# EAGLE design E-P-099-R2.2 (EAGLE 7.3.0)
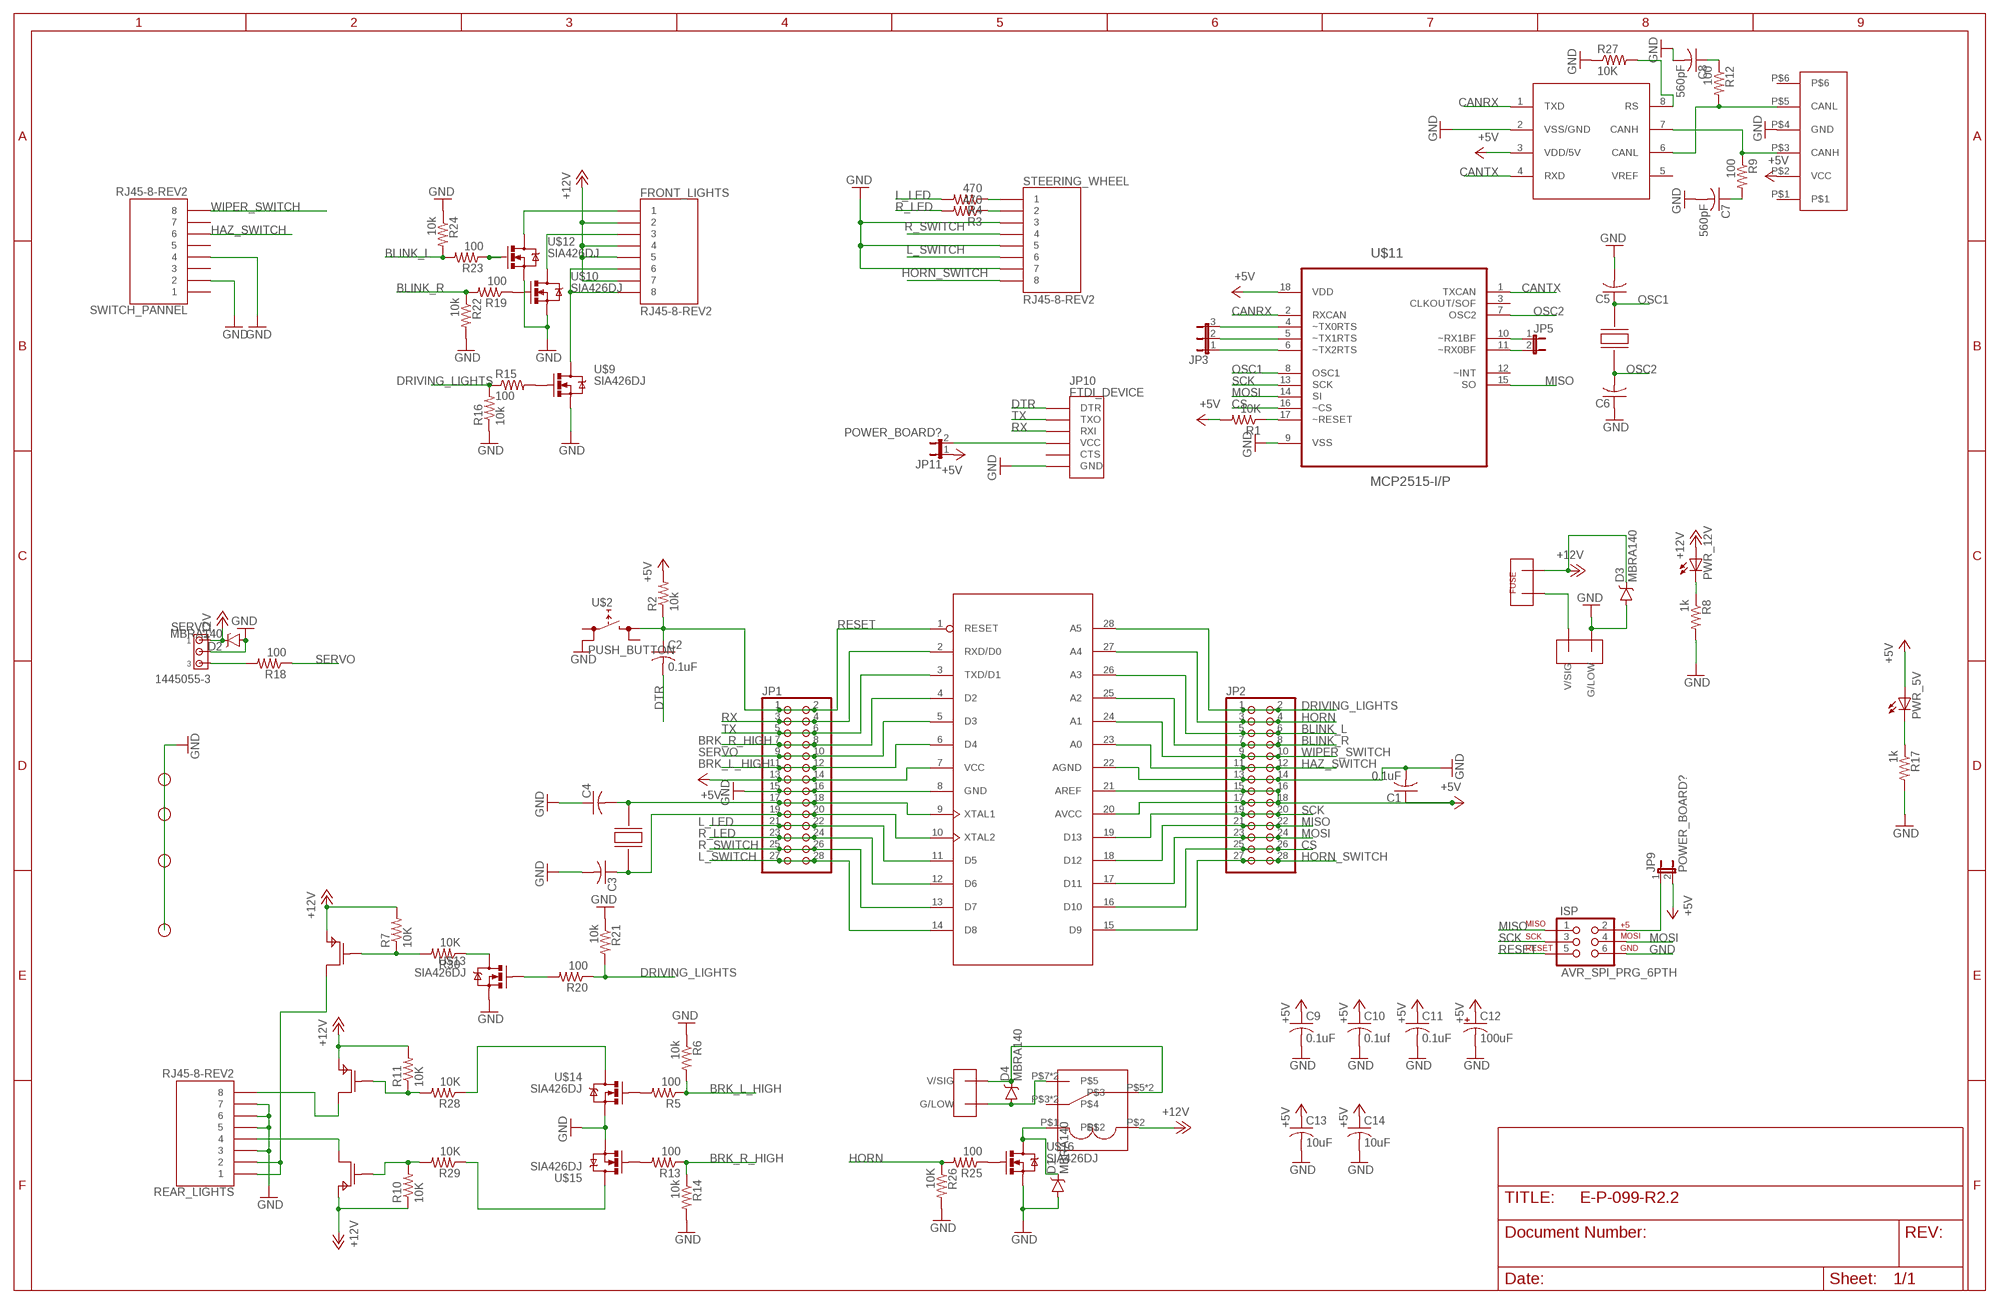
[diagram p0: schematic, sheet 1]

## Parts
C1  0.1uF  C-USC0805  [C0805]
C2  0.1uF  C-USC0805  [C0805]
C3  C-USC0805  [C0805]
C4  C-USC0805  [C0805]
C5  C-USC0805  [C0805]
C6  C-USC0805  [C0805]
C7  560pF  C-USC0805  [C0805]
C8  560pF  C-USC0805  [C0805]
C9  0.1uF  C-USC0805  [C0805]
C10  0.1uf  C-USC0805  [C0805]
C11  0.1uF  C-USC0805  [C0805]
C12  100uF  CAP_POLC  [PANASONIC_C]
C13  10uF  C-USC0805  [C0805]
C14  10uF  C-USC0805  [C0805]
CAN_BUS  CAN_6P6C  [CAN_6P6C]
D1  MBRA140  [SMA-DIODE]
D2  MBRA140  [SMA-DIODE]
D3  MBRA140  [SMA-DIODE]
D4  MBRA140  [SMA-DIODE]
FRONT_LIGHTS  RJ45-8-REV2  [RJ45-8]
HORN  TE770966  [2X1-MATE-N-LOCK]
ISP  AVR_SPI_PRG_6PTH  [2X3]
JP1  PINHD-2X14  [2X14]
JP2  PINHD-2X14  [2X14]
JP3  JP2E  [JP2]
JP4  STAND-OFF  [STAND-OFF]
JP5  JP1E  [JP1]
JP6  STAND-OFF  [STAND-OFF]
JP7  STAND-OFF  [STAND-OFF]
JP8  STAND-OFF  [STAND-OFF]
JP9  POWER_BOARD?  JUMPER-2PTH  [1X02]
JP10  FTDI_DEVICE  [FTDI_DEVICE_SIDE]
JP11  POWER_BOARD?  JUMPER-2PTH  [1X02]
PWR_5V  LEDCHIPLED_1206  [CHIPLED_1206]
PWR_12V  LEDCHIPLED_1206  [CHIPLED_1206]
R1  10K  R-US_M0805  [M0805]
R2  10k  R-US_M0805  [M0805]
R3  470  R-US_M0805  [M0805]
R4  470  R-US_M0805  [M0805]
R5  100  R-US_M0805  [M0805]
R6  10k  R-US_M0805  [M0805]
R7  10K  R-US_M0805  [M0805]
R8  1k  R-US_M0805  [M0805]
R9  100  R-US_M0805  [M0805]
R10  10K  R-US_M0805  [M0805]
R11  10K  R-US_M0805  [M0805]
R12  100  R-US_M0805  [M0805]
R13  100  R-US_M0805  [M0805]
R14  10k  R-US_M0805  [M0805]
R15  100  R-US_M0805  [M0805]
R16  10k  R-US_M0805  [M0805]
R17  1k  R-US_M0805  [M0805]
R18  100  R-US_M0805  [M0805]
R19  100  R-US_M0805  [M0805]
R20  100  R-US_M0805  [M0805]
R21  10k  R-US_M0805  [M0805]
R22  10k  R-US_M0805  [M0805]
R23  100  R-US_M0805  [M0805]
R24  10k  R-US_M0805  [M0805]
R25  100  R-US_M0805  [M0805]
R26  10K  R-US_M0805  [M0805]
R27  10K  R-US_M0805  [M0805]
R28  10K  R-US_M0805  [M0805]
R29  10K  R-US_M0805  [M0805]
R30  10K  R-US_M0805  [M0805]
REAR_LIGHTS  RJ45-8-REV2  [RJ45-8]
SERVO  1445055-3  [1445055-3]
STEERING_WHEEL  RJ45-8-REV2  [RJ45-8]
SWITCH_PANNEL  RJ45-8-REV2  [RJ45-8]
U$1  ATMEGA328  [DIP28-0.3IN]
U$2  PUSH_BUTTON  [PUSHBUTTON]
U$3  MCP2551DIP  [DIP8]
U$4  CRYSTAL  [7A_CRYSTAL]
U$5  TE770966  [2X1-MATE-N-LOCK]
U$6  CRYSTAL  [7A_CRYSTAL]
U$7  RELAY  [RTD34012]
U$8  FUSEMINI-BLADE  [MINI-BLADE-FUSE]
U$9  SIA426DJ  [SC70-6L]
U$10  SIA426DJ  [SC70-6L]
U$11  MCP2515-I/P  [DIP254P762X432-18]
U$12  SIA426DJ  [SC70-6L]
U$13  SIA426DJ  [SC70-6L]
U$14  SIA426DJ  [SC70-6L]
U$15  SIA426DJ  [SC70-6L]
U$16  SIA426DJ  [SC70-6L]
U$17  SIA449DJ  [SIA449DJ-T1-GE3CT-ND]
U$18  SIA449DJ  [SIA449DJ-T1-GE3CT-ND]
U$19  SIA449DJ  [SIA449DJ-T1-GE3CT-ND]

## Nets
+5V: C1.1 C9.1 C10.1 C11.1 C12.+ C13.1 C14.1 CAN_BUS.P$2(VCC) JP1.13 JP1.14 JP2.15 JP2.16 JP2.17 JP2.18 JP9.2 JP11.1 PWR_5V.A R1.2 R2.2 U$1.7(VCC) U$1.20(AVCC) U$1.21(AREF) U$3.3(VDD/5V) U$11.18(VDD)
+12V: D2.C D3.C FRONT_LIGHTS.2 FRONT_LIGHTS.4 FRONT_LIGHTS.5 FRONT_LIGHTS.7 PWR_12V.A R7.2 R10.1 R11.2 SERVO.1 U$7.P$2 U$8.OUT U$17.P$5(P$S) U$17.P$6(P$S) U$18.P$5(P$S) U$18.P$6(P$S) U$19.P$5(P$S) U$19.P$6(P$S)
BLINK_L: JP2.5 JP2.6 R23.2 R24.2 U$1.26(A3)
BLINK_R: JP2.7 JP2.8 R19.2 R22.1 U$1.25(A2)
BRK_L_HIGH: JP1.11 JP1.12 R5.1 R6.2 U$1.6(D4)
BRK_R_HIGH: JP1.7 JP1.8 R13.1 R14.1 U$1.4(D2)
CANRX: U$3.1(TXD) U$11.2(RXCAN)
CANTX: U$3.4(RXD) U$11.1(TXCAN)
CS: JP2.25 JP2.26 U$1.16(D10) U$11.16(~CS)
DRIVING_LIGHTS: JP2.1 JP2.2 R15.1 R16.2 R20.1 R21.2 U$1.28(A5)
DTR: C2.2 JP10.P$1(DTR)
GND: C1.2 C3.2 C4.1 C5.2 C6.1 C7.2 C8.2 C9.2 C10.2 C11.2 C12.- C13.2 C14.2 CAN_BUS.P$4(GND) D1.A D2.A D3.A ISP.6 JP1.15 JP1.16 JP2.13 JP2.14 JP10.P$6(GND) R6.1 R8.2 R14.2 R16.1 R17.2 R21.1 R22.2 R24.1 R26.2 R27.1 REAR_LIGHTS.3 REAR_LIGHTS.5 REAR_LIGHTS.6 REAR_LIGHTS.7 SERVO.2 STEERING_WHEEL.3 STEERING_WHEEL.5 STEERING_WHEEL.7 SWITCH_PANNEL.2 SWITCH_PANNEL.4 U$1.8(GND) U$1.22(AGND) U$2.L2(L) U$3.2(VSS/GND) U$5.CIRCUIT2(G/LOW) U$9.S@0(S) U$9.S@1(S) U$10.S@0(S) U$10.S@1(S) U$11.9(VSS) U$12.S@0(S) U$12.S@1(S) U$13.S@0(S) U$13.S@1(S) U$14.S@0(S) U$14.S@1(S) U$15.S@0(S) U$15.S@1(S) U$16.S@0(S) U$16.S@1(S)
HAZ_SWITCH: JP2.11 JP2.12 SWITCH_PANNEL.6 U$1.23(A0)
HORN: JP2.3 JP2.4 R25.2 R26.1 U$1.27(A4)
HORN_SWITCH: JP2.27 JP2.28 STEERING_WHEEL.8 U$1.15(D9)
L_LED: JP1.21 JP1.22 R4.2 U$1.11(D5)
L_SWITCH: JP1.27 JP1.28 STEERING_WHEEL.6 U$1.14(D8)
MISO: ISP.1 JP2.21 JP2.22 U$1.18(D12) U$11.15(SO)
MOSI: ISP.4 JP2.23 JP2.24 U$1.17(D11) U$11.14(SI)
N$1: CAN_BUS.P$3(CANH) R9.1 U$3.7(CANH)
N$2: PWR_12V.C R8.1
N$3: REAR_LIGHTS.4 U$19.P$1(P$D)
N$4: C8.1 R12.1
N$5: ISP.2 JP9.1
N$6: C7.1 R9.2
N$7: R13.2 U$15.G
N$8: FRONT_LIGHTS.1 U$12.D
N$9: CAN_BUS.P$5(CANL) R12.2 U$3.6(CANL)
N$10: REAR_LIGHTS.1 REAR_LIGHTS.2 U$17.P$1(P$D)
N$11: C3.1 JP1.19 JP1.20 U$1.10(XTAL2) U$4.P$1
N$12: R3.1 STEERING_WHEEL.2
N$13: R4.1 STEERING_WHEEL.1
N$14: FRONT_LIGHTS.3 U$10.D
N$15: R18.2 SERVO.3
N$16: R15.2 U$9.G
N$17: FRONT_LIGHTS.6 FRONT_LIGHTS.8 U$9.D
N$18: D4.C HORN.CIRCUIT1(V/SIG) U$7.P$5 U$7.P$6
N$19: C4.2 JP1.17 JP1.18 U$1.9(XTAL1) U$4.P$2
N$20: JP3.3 U$11.4(~TX0RTS)
N$21: R5.2 U$14.G
N$22: R7.1 R30.2 U$17.P$4(P$G)
N$23: JP10.P$4(VCC) JP11.2
N$24: R20.2 U$13.G
N$25: REAR_LIGHTS.8 U$18.P$1(P$D)
N$26: R27.2 U$3.8(RS)
N$27: R1.1 U$11.17(~RESET)
N$28: D4.A HORN.CIRCUIT2(G/LOW) U$7.P$7 U$7.P$8
N$29: R25.1 U$16.G
N$30: D1.C U$7.P$1 U$16.D
N$31: R11.1 R28.2 U$18.P$4(P$G)
N$32: R10.2 R29.2 U$19.P$4(P$G)
N$33: R19.1 U$10.G
N$34: R30.1 U$13.D
N$37: R23.1 U$12.G
N$41: PWR_5V.C R17.1
N$43: R28.1 U$14.D
N$45: R29.1 U$15.D
N$47: U$5.CIRCUIT1(V/SIG) U$8.IN
N$52: JP3.2 U$11.5(~TX1RTS)
N$56: JP3.1 U$11.6(~TX2RTS)
N$62: JP5.1 U$11.10(~RX1BF)
N$63: JP5.2 U$11.11(~RX0BF)
OSC1: C5.1 U$6.P$2 U$11.8(OSC1)
OSC2: C6.2 U$6.P$1 U$11.7(OSC2)
R_LED: JP1.23 JP1.24 R3.2 U$1.12(D6)
R_SWITCH: JP1.25 JP1.26 STEERING_WHEEL.4 U$1.13(D7)
RESET: C2.1 ISP.5 JP1.1 JP1.2 R2.1 U$1.1(RESET) U$2.R1(R)
RX: JP1.3 JP1.4 JP10.P$3(RXI) U$1.2(RXD/D0)
SCK: ISP.3 JP2.19 JP2.20 U$1.19(D13) U$11.13(SCK)
SERVO: JP1.9 JP1.10 R18.1 U$1.5(D3)
TX: JP1.5 JP1.6 JP10.P$2(TXO) U$1.3(TXD/D1)
WIPER_SWITCH: JP2.9 JP2.10 SWITCH_PANNEL.8 U$1.24(A1)
Unconnected: CAN_BUS.P$1 CAN_BUS.P$6 JP10.P$5(CTS) SWITCH_PANNEL.1 SWITCH_PANNEL.3 SWITCH_PANNEL.5 SWITCH_PANNEL.7 U$2.L1(L) U$2.R2(R) U$3.5(VREF) U$7.P$3 U$7.P$4 U$11.3(CLKOUT/SOF) U$11.12(~INT)

## Library data of the parts
C1-C11 C13 C14 = adafruit:C-US: CAPACITOR, American symbol
C12 = SparkFun-Capacitors:CAP_POL: Capacitor Polarized These are standard SMD and PTH capacitors. Normally 10uF, 47uF, and 100uF in electrolytic and tantalum varieties. Always verify the external diameter of the through hole cap, it varies with capacity, voltage, and manufacturer. The EIA devices should be standard.
CAN_BUS = mylibrary:CAN_6P6C: Digikey part: 553-2258-ND
D1-D4 = SparkFun-DiscreteSemi:MBRA140: 40V, 1A Schottky rectifier SMA/DO-214AC package DIO-08053; PROD_ID: DIO-08053
FRONT_LIGHTS REAR_LIGHTS STEERING_WHEEL SWITCH_PANNEL = E14-P-099-R21.2(US_drills):RJ45-8-REV2
HORN U$5 = Shell2013(1):TE770966
ISP = SparkFun:AVR_SPI_PRG_6: AVR ISP 6 Pin This is the reduced ISP connector for AVR programming. Common on Arduino. This footprint will take up less PCB space and can be used with a 10-pin to 6-pin adapter such as SKU: BOB-08508
JP1 JP2 = pinhead:PINHD-2X14: PIN HEADER
JP3 = DAQTEST:JP2E: JUMPER
JP4 JP6-JP8 = SparkFun:STAND-OFF: Stand Off This is the mechanical footprint for a #4 phillips button head screw. Use the keepout ring to avoid running the screw head into surrounding components. SKU : PRT-00447
JP5 = jumper:JP1E: JUMPER
JP9 JP11 = SparkFun:JUMPER-2: Jumper Basic 0.1" spaced jumper. Use with breakaway headers.
JP10 = SparkFun-Connectors:FTDI_DEVICE: Connector which mates to FTDI basic or FTDI cable.
PWR_5V PWR_12V = E14-P-099-R21.2(US_drills):LED: LED OSRAM: - CHIPLED LG R971, LG N971, LY N971, LG Q971, LY Q971, LO R971, LY R971 LH N974, LH R974 LS Q976, LO Q976, LY Q976 LO Q996 - Hyper CHIPLED LW Q18S LB Q993, LB Q99A, LB R99A - SideLED LS A670, LO A670, LY A670, LG A670, LP A670 LB A673, LV A673, LT A673, LW A673 LH A674 LY A675 LS A676, LA A676, LO A676, LY A676, LW A676 LS A679, LY A679, LG A679 - Hyper Micro SIDELED® LS Y876, LA Y876, LO Y876, LY Y876 LT Y87S - SmartLED LW L88C, LW L88S LB L89C, LB L89S, LG L890 LS L89K, LO L89K, LY L89K LS L896, LA L896, LO L896, LY L896 - TOPLED LS T670, LO T670, LY T670, LG T670, LP T670 LSG T670, LSP T670, LSY T670, LOP T670, LYG T670 LG T671, LOG T671, LSG T671 LB T673, LV T673, LT T673, LW T673 LH T674 LS T676, LA T676, LO T676, LY T676, LB T676, LH T676, LSB T676, LW T676 LB T67C, LV T67C, LT T67C, LS T67K, LO T67K, LY T67K, LW E67C LS E67B, LA E67B, LO E67B, LY E67B, LB E67C, LV E67C, LT E67C LW T67C LS T679, LY T679, LG T679 LS T770, LO T770, LY T770, LG T770, LP T770 LB T773, LV T773, LT T773, LW T773 LH T774 LS E675, LA E675, LY E675, LS T675 LS T776, LA T776, LO T776, LY T776, LB T776 LHGB T686 LT T68C, LB T68C - Hyper Mini TOPLED® LB M676 - Mini TOPLED Santana® LG M470 LS M47K, LO M47K, LY M47K Source: http://www.osram.convergy.de LUXEON: - LUMILED® LXK2-PW12-R00, LXK2-PW12-S00, LXK2-PW14-U00, LXK2-PW14-V00 LXK2-PM12-R00, LXK2-PM12-S00, LXK2-PM14-U00 LXK2-PE12-Q00, LXK2-PE12-R00, LXK2-PE12-S00, LXK2-PE14-T00, LXK2-PE14-U00 LXK2-PB12-K00, LXK2-PB12-L00, LXK2-PB12-M00, LXK2-PB14-N00, LXK2-PB14-P00, LXK2-PB14-Q00 LXK2-PR12-L00, LXK2-PR12-M00, LXK2-PR14-Q00, LXK2-PR14-R00 LXK2-PD12-Q00, LXK2-PD12-R00, LXK2-PD12-S00 LXK2-PH12-R00, LXK2-PH12-S00 LXK2-PL12-P00, LXK2-PL12-Q00, LXK2-PL12-R00 Source: www.luxeon.com KINGBRIGHT: KA-3528ASYC Source: www.kingbright.com
R1-R30 = adafruit:R-US_: RESISTOR, American symbol
SERVO = con-amp:1445055-3: Micro MATE-N-LOK Connectors grid 1.5 mm Source: ENG_CD_1445055_A.pdf
U$1 = E14-P-099-R21.2(US_drills):ATMEGA328
U$2 = E14-P-099-R21.2:PUSH_BUTTON
U$3 = Shell2013:MCP2551
U$4 U$6 = mylibrary:CRYSTAL
U$7 = mylibrary:RELAY
U$8 = Shell2013:FUSE
U$9 U$10 U$12-U$16 = Shell2013:SIA426DJ
U$11 = Microchip_By_element14_Batch_1:MCP2515-I/P: Stand-Alone CAN Controller; DESCRIPTION: CAN CONTRL; MPN: MCP2515-I/P; OC_FARNELL: 1439391; OC_NEWARK: 61K2945; PACKAGE: PDIP-18; SUPPLIER: MICROCHIP
U$17-U$19 = Shell2015:SIA449DJ: 30V 12A P-Mosfet Digikey: SIA449DJ-T1-GE3CT-ND

## Board
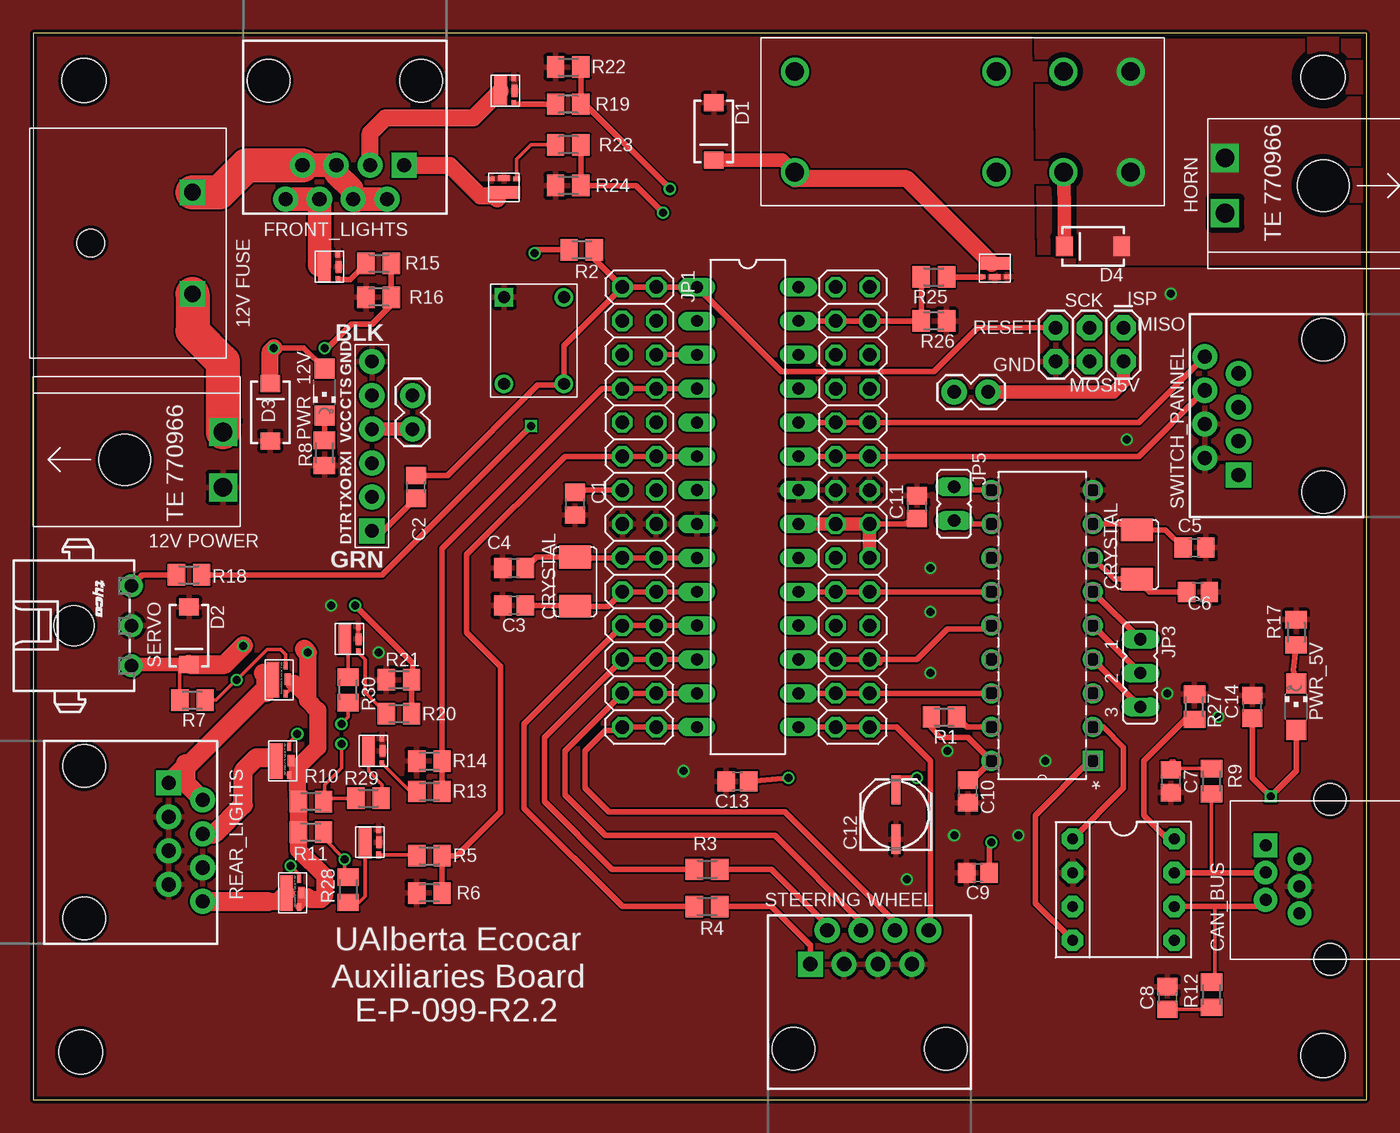
[diagram p1: board, top side]
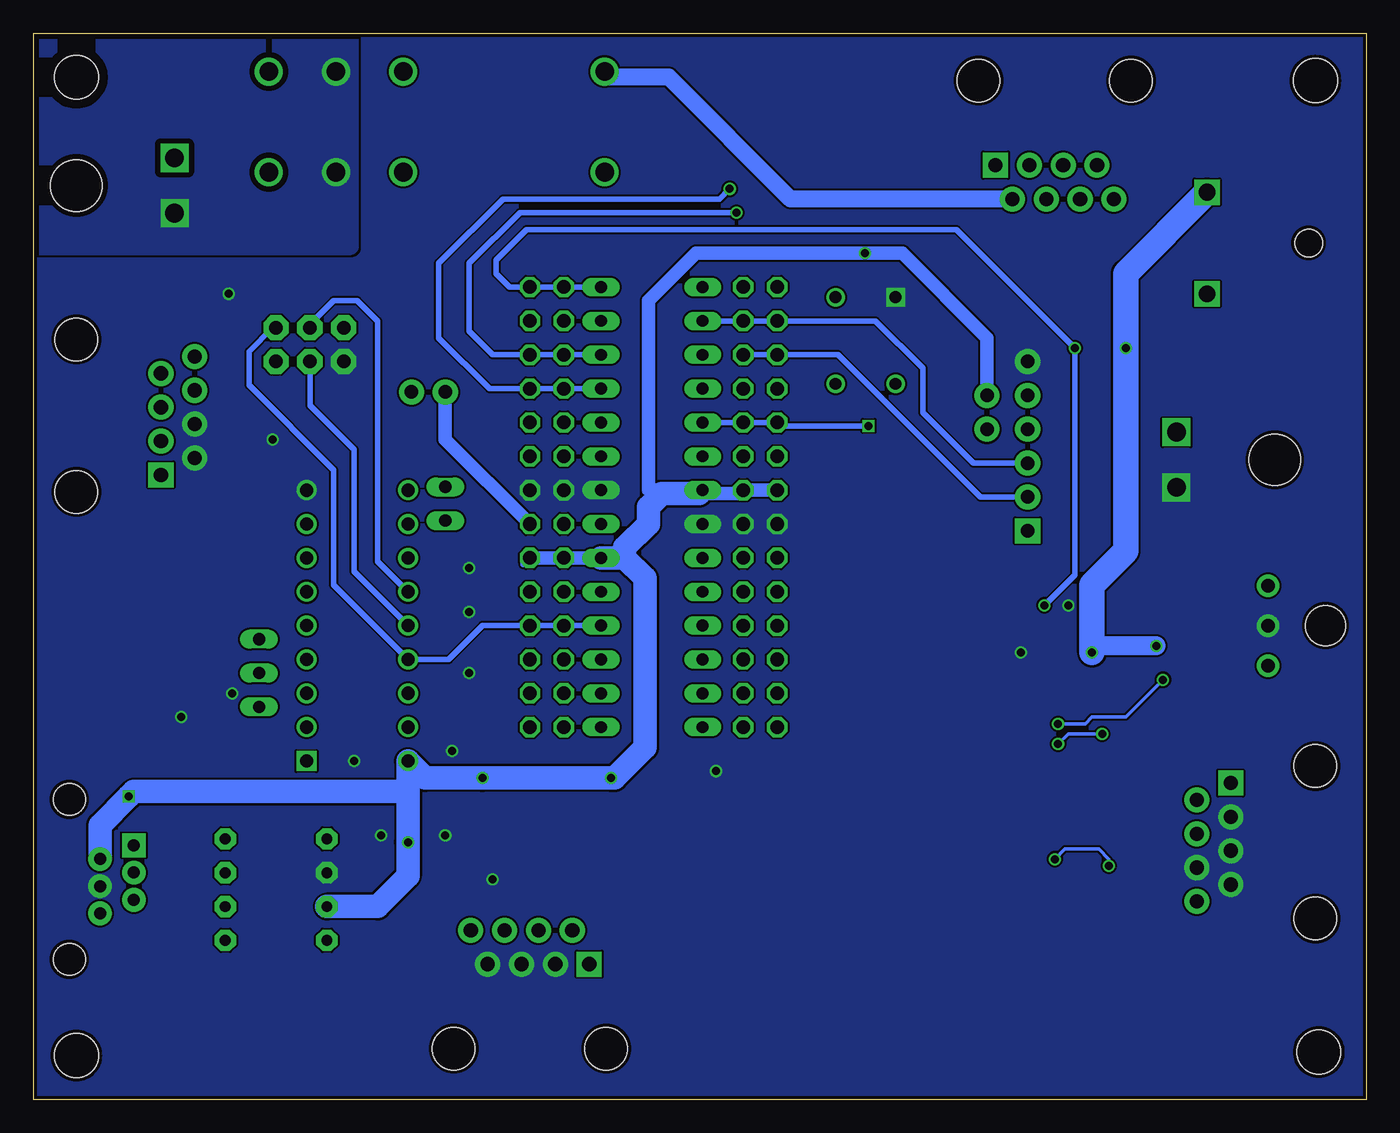
[diagram p2: board, bottom side, seen from below]

Size 100 x 80 mm. Coordinates in mm from the lower left corner, seen from the top.
Outline: 0,0 100,0 100,80 0,80 0,0
Copper layers (1*16): Top 0.035mm / dielectric 1.5mm / Bottom 0.035mm
Design rules "ITEADstudio_DRC": minimum track width 6mil, minimum drill 12mil, track to track 6mil, track to pad 6mil, pad to pad 6mil, via to via 6mil, smd to smd 0mil, copper to edge 10mil, drill to drill 10mil, minimum pad ring 10mil, minimum via ring 6mil, stop-mask expansion 2mil, vias tented up to drill 100mil, thermal gap 10mil

### Footprints (pad centres in the part's own frame; a part is rotated, then mirrored left to right if it is on the bottom)
C0805 = smd 1.3 x 1.5: 1 -0.85,0; 2 0.85,0
PANASONIC_C = smd 2.2 x 0.65: + 1.9,-0.2; - -1.8,-0.2
CAN_6P6C = drill 0.9 pad 1.778 square: P$1 4.08,0 | drill 0.9 pad 1.778: P$2 3.06,-2.54; P$3 2.04,0; P$4 1.02,-2.54; P$5 0,0; P$6 -1.02,-2.54 | hole 2.4: -4.47,-4.84; 7.53,-4.84
SMA-DIODE = smd 1.27 x 1.47: A -2.15,0; C 2.15,0
RJ45-8 = drill 1.067 pad 1.88 square: 1 -4.445,6.35 | drill 1.067 pad 1.88: 2 -3.175,8.89; 3 -1.905,6.35; 4 -0.635,8.89; 5 0.635,6.35; 6 1.905,8.89; 7 3.175,6.35; 8 4.445,8.89 | hole 3.2: -5.715,0; 5.715,0
2X1-MATE-N-LOCK = drill 1.4 square: CIRCUIT1 -2.07,14.23; CIRCUIT2 2.07,14.23 | hole 3.86: 0,6.86
2X3 = drill 1.016 pad 1.88 octagon: 1 0,0; 2 0,2.54; 3 2.54,0; 4 2.54,2.54; 5 5.08,0; 6 5.08,2.54
2X14 = drill 1.016 octagon: 1 -16.51,-1.27; 2 -16.51,1.27; 3 -13.97,-1.27; 4 -13.97,1.27; 5 -11.43,-1.27; 6 -11.43,1.27; 7 -8.89,-1.27; 8 -8.89,1.27; 9 -6.35,-1.27; 10 -6.35,1.27; 11 -3.81,-1.27; 12 -3.81,1.27; 13 -1.27,-1.27; 14 -1.27,1.27; 15 1.27,-1.27; 16 1.27,1.27; 17 3.81,-1.27; 18 3.81,1.27; 19 6.35,-1.27; 20 6.35,1.27; 21 8.89,-1.27; 22 8.89,1.27; 23 11.43,-1.27; 24 11.43,1.27; 25 13.97,-1.27; 26 13.97,1.27; 27 16.51,-1.27; 28 16.51,1.27
JP2 = drill 0.914 long: 1 -2.54,0; 2 0,0; 3 2.54,0
STAND-OFF = hole 3.302: 0,0
JP1 = drill 0.914 long: 1 0,-1.27; 2 0,1.27
1X02 = drill 1.016 pad 1.88: 1 0,0; 2 2.54,0
FTDI_DEVICE_SIDE = drill 1.016 pad 1.88 square: P$1 -6.35,0 | drill 1.016 pad 1.88: P$2 -3.81,0; P$3 -1.27,0; P$4 1.27,0; P$5 3.81,0; P$6 6.35,0
CHIPLED_1206 = smd 1.5 x 1.5: A 0,-1.75; C 0,1.75
M0805 = smd 1.3 x 1.6: 1 -0.95,0; 2 0.95,0
1445055-3 = drill 1 pad 1.676: 1 3,4.32; 2 0,4.32; 3 -3,4.32 | hole 3: 0,0
DIP28-0.3IN = drill 0.889 long: 1 -16.51,-3.81; 2 -13.97,-3.81; 3 -11.43,-3.81; 4 -8.89,-3.81; 5 -6.35,-3.81; 6 -3.81,-3.81; 7 -1.27,-3.81; 8 1.27,-3.81; 9 3.81,-3.81; 10 6.35,-3.81; 11 8.89,-3.81; 12 11.43,-3.81; 13 13.97,-3.81; 14 16.51,-3.81; 15 16.51,3.81; 16 13.97,3.81; 17 11.43,3.81; 18 8.89,3.81; 19 6.35,3.81; 20 3.81,3.81; 21 1.27,3.81; 22 -1.27,3.81; 23 -3.81,3.81; 24 -6.35,3.81; 25 -8.89,3.81; 26 -11.43,3.81; 27 -13.97,3.81; 28 -16.51,3.81
PUSHBUTTON = drill 0.889: L1 0,4.5; R1 6.5,4.5; R2 6.5,0 | drill 0.889 square: L2 0,0
DIP8 = drill 0.813 pad 1.6 octagon: 1 1.27,-3.81; 2 3.81,-3.81; 3 6.35,-3.81; 4 8.89,-3.81; 5 8.89,3.81; 6 6.35,3.81; 7 3.81,3.81; 8 1.27,3.81
7A_CRYSTAL = smd 1.7 x 2.4: P$1 -1.85,0; P$2 1.85,0
RTD34012 = drill 1.4: P$1 2.52,2.52; P$2 2.52,10.08; P$3 17.64,10.08; P$4 17.64,2.52; P$5 22.68,2.52; P$6 22.68,10.08; P$7 27.72,10.08; P$8 27.72,2.52
MINI-BLADE-FUSE = drill 1.27 square: IN 3.81,7.62; OUT -3.81,7.62 | hole 2.083: 0,0
SC70-6L = smd 0.95 x 2.4: D 0,0 | smd 0.35 x 0.5: G 1.01,-0.95; S@0 1.01,0.95 | smd 0.45 x 0.87: S@1 1.05,0
DIP254P762X432-18 = drill 0.991 square: 1 -7.62,20.32 | drill 0.991: 2 -7.62,17.78; 3 -7.62,15.24; 4 -7.62,12.7; 5 -7.62,10.16; 6 -7.62,7.62; 7 -7.62,5.08; 8 -7.62,2.54; 9 -7.62,0; 10 0,0; 11 0,2.54; 12 0,5.08; 13 0,7.62; 14 0,10.16; 15 0,12.7; 16 0,15.24; 17 0,17.78; 18 0,20.32
SIA449DJ-T1-GE3CT-ND = smd 0.95 x 2.67: P$1 -0.325,0 | smd 0.3 x 0.55: P$4 0.65,1.05; P$6 0.65,-1.05 | smd 0.5 x 0.87: P$5 0.8,0.04

### Placement (x,y rotation side)
C1  40.64,44.7 270 top
C2  28.7,45.97 270 top
C3  36.07,37.08 180 top
C4  36.07,39.88 0 top
C5  87.12,41.4 0 top
C6  87.38,38.1 180 top
C7  85.34,23.88 270 top
C8  85.09,7.62 90 top
C9  70.87,17.02 180 top
C10  70.1,23.11 270 top
C11  66.29,44.45 90 top
C12  64.52,21.34 90 top
C13  52.83,23.88 180 top
C14  91.44,29.46 90 top
CAN_BUS  92.46,14.99 90 top
D1  51.05,72.64 270 top
D2  11.68,34.8 270 top
D3  17.78,51.56 90 top
D4  79.5,64.01 180 top
FRONT_LIGHTS  23.37,76.45 180 top
HORN  103.63,68.58 90 top
ISP  81.79,57.91 180 top
JP1  45.47,44.45 270 top
JP2  61.47,44.45 270 top
JP3  83.06,32 270 top
JP4  3.56,3.56 0 top
JP5  69.09,44.7 180 top
JP6  96.77,3.3 0 top
JP7  96.77,76.71 0 top
JP8  3.81,76.45 0 top
JP9  71.63,53.09 180 top
JP10  25.4,49.02 90 top
JP11  28.45,52.83 270 top
PWR_5V  94.74,29.46 0 top
PWR_12V  21.84,53.09 180 top
R1  68.33,28.7 180 top
R2  41.15,63.75 180 top
R3  50.55,17.27 180 top
R4  50.55,14.48 180 top
R5  29.72,18.29 180 top
R6  29.72,15.49 0 top
R7  11.94,29.97 180 top
R8  21.84,48.51 270 top
R9  88.39,23.88 90 top
R10  20.83,22.35 0 top
R11  20.83,20.07 180 top
R12  88.39,7.87 90 top
R13  29.72,23.11 180 top
R14  29.72,25.4 180 top
R15  25.91,62.74 180 top
R16  25.91,60.2 0 top
R17  94.74,35.05 90 top
R18  11.68,39.37 180 top
R19  40.13,74.68 0 top
R20  27.43,28.96 180 top
R21  27.43,31.5 0 top
R22  40.13,77.47 180 top
R23  40.13,71.63 0 top
R24  40.13,68.58 0 top
R25  67.56,61.72 180 top
R26  67.56,58.42 0 top
R27  87.12,29.46 270 top
R28  23.62,15.75 90 top
R29  25.15,22.61 180 top
R30  23.62,30.73 270 top
REAR_LIGHTS  3.81,19.3 270 top
SERVO  3.05,35.56 270 top
STEERING_WHEEL  62.74,3.81 0 top
SWITCH_PANNEL  96.77,51.31 90 top
U$1  53.59,44.45 270 top
U$2  35.31,60.2 270 top
U$3  81.79,20.83 270 top
U$4  40.64,38.86 90 top
U$5  0,48.01 270 top
U$6  82.8,40.89 90 top
U$7  54.61,67.06 0 top
U$8  4.32,64.26 270 top
U$9  21.84,62.48 0 top
U$10  35.05,75.69 0 top
U$11  71.88,45.72 180 top
U$12  35.31,68.07 90 top
U$13  23.37,34.54 0 top
U$14  24.89,19.3 0 top
U$15  25.15,26.16 0 top
U$16  72.14,62.74 270 top
U$17  18.29,31.5 0 top
U$18  19.3,15.49 0 top
U$19  18.54,25.4 0 top

### Tracks (layer width: path | path; a pad name or v marks a point on that pad's centre or on a via)
+5V  (via drill 0.6)
  Top 0.406: R2.2 37.85,63.75 v37.59,63.5 | JP1.13 40.81,45.72 C1.1 | PWR_5V.A 94.74,24.64 v92.84,22.73 91.44,24.13 C14.1 | C12.+ 64.72,24.08 64.77,24.13 v66.29,24.13 | JP2.16 65.37,43.18 C11.1 | C9.1 71.72,19.14 v71.88,19.3 | R1.2 67.38,27.87 68.07,27.18 70.1,27.18 U$11.18 70.45,23.96 C10.1 | C13.1 v56.64,24.13
  Top 1.016: JP2.18 JP2.16 JP2.15 U$1.21
  Bottom 0.406: 50.04,45.47 49.78,45.47 U$1.7 | 46.99,45.47 JP1.14 | v92.84,22.73 90.3,22.73 89.92,23.11 | JP2.18 63.25,40.39 63.25,40.13 62.74,40.13 JP2.18
  Bottom 1.016: U$1.20 JP2.17 JP2.18 | 49.78,45.47 46.99,45.47 | JP1.14 JP1.13 | U$1.7 53.85,45.72 53.85,59.94 50.29,63.5 v37.59,63.5 34.8,63.5 28.45,57.15 JP11.1 | JP9.2 69.09,49.53 JP2.16
  Bottom 1.778: U$1.20 55.63,40.64 | 55.63,40.64 54.1,39.12 54.1,26.42 56.39,24.13 v56.64,24.13 v66.29,24.13 70.61,24.13 U$11.18 71.88,23.37 | 71.88,23.37 v71.88,19.3 71.88,16.76 74.17,14.48 U$3.3 | 55.63,40.64 55.63,41.4 53.85,43.18 53.85,44.45 52.83,45.47 50.04,45.47 | CAN_BUS.P$2 95,20.57 v92.84,22.73 92.46,23.11 89.92,23.11 72.14,23.11 71.88,23.37
+12V  (via drill 0.6)
  Top 0.254: U$17.P$6 19.56,31.07 19.56,31.24 19.26,31.54 U$17.P$5 | R7.2 10.99,32.46 11.18,32.65
  Top 0.406: v18.03,56.39 20.29,56.39 PWR_12V.A | U$19.P$6 19.73,24.89 19.81,24.89 19.81,24.97 U$19.P$5
  Top 0.61: 20.57,15.24 20.4,15.24 U$18.P$5 20.1,14.59 U$18.P$6
  Top 1.016: D2.C 11.18,32.65 7.46,32.65 SERVO.1
  Top 1.27: 20.51,33.59 v20.57,33.53 20.57,30.23 | D3.C 17.78,56.13 v18.03,56.39 | 20.57,15.24 20.83,14.99 21.59,14.99 21.84,15.24 21.84,16.76 19.88,18.73 R11.2 R10.1 19.81,23.43 19.81,24.89 21.34,26.42 21.34,29.21 20.57,29.97 20.57,30.23 | 20.57,30.23 19.56,31.24
  Top 1.422: 20.32,33.78 v20.57,33.53 | D2.C 14.36,32.65 v15.75,34.04
  Top 1.778: FRONT_LIGHTS.7 FRONT_LIGHTS.5 22.73,69.47 23.88,68.33 24.13,67.44 FRONT_LIGHTS.4 FRONT_LIGHTS.2
  Top 2.54: U$8.OUT 13.97,68.07 16,70.1 FRONT_LIGHTS.7
  Bottom 1.016: 57.3,76.71 U$7.P$2
  Bottom 1.27: FRONT_LIGHTS.2 43.18,67.56 52.32,76.71 57.3,76.71
  Bottom 1.422: v15.75,34.04 20.07,34.04 v20.57,33.53
  Bottom 1.93: v20.57,33.53 20.57,38.61 18.03,41.15 v18.03,56.39 18.03,61.98 U$8.OUT
BLINK_L  (via drill 0.6)
  Top 0.406: R23.2 R24.2 45.21,68.58 v47.24,66.55
  Bottom 0.406: U$1.26 JP2.5 JP2.6 65.53,55.88 67.31,57.66 67.31,62.74 63.5,66.55 v47.24,66.55
BLINK_R  (via drill 0.6)
  Top 0.406: R22.1 R19.2 41.4,74.68 v47.75,68.33
  Bottom 0.406: U$1.25 JP2.7 JP2.8 65.79,53.34 69.6,57.15 69.6,62.74 64.77,67.56 48.51,67.56 v47.75,68.33
BRK_L_HIGH
  Top 0.406: U$1.6 JP1.12 JP1.11 39.88,48.26 32.51,40.89 32.51,35.05 35.05,32.51 35.05,21.59 31.75,18.29 R5.1 R6.2
BRK_R_HIGH
  Top 0.406: U$1.4 JP1.8 JP1.7 42.67,53.34 30.67,41.34 R14.1 R13.1
CANRX
  Top 0.406: U$11.2 80.26,27.94 81.79,26.42 81.79,23.37 U$3.1
CANTX
  Top 0.406: U$11.1 79.25,25.4 75.18,21.34 75.18,14.73 U$3.4
CS
  Top 0.406: U$11.16 JP2.26 JP2.25 U$1.16
DRIVING_LIGHTS  (via drill 0.6)
  Top 0.406: R15.1 R16.2 26.92,60.13 26.92,59.69 25.4,58.17 23.88,58.17 22.1,56.39 v21.84,56.39 | v24.13,37.08 28.45,32.77 28.45,31.56 R21.2 R20.1
  Bottom 0.406: v24.13,37.08 21.84,39.37 v21.84,56.39 30.73,65.28 62.99,65.28 65.28,62.99 65.28,61.98 64.26,60.96 JP2.2 JP2.1 U$1.28
DTR
  Top 0.406: JP10.P$1 26.25,42.67 C2.2
GND  (via drill 0.6)
  Top 0.254: U$13.S@0 24.38,34.58 U$13.S@1
  other vias: 82.04,49.53 85.34,60.45 85.09,30.48 88.9,28.7 68.58,26.16 67.31,32 67.31,36.58 67.31,39.88 73.91,19.81 75.95,25.4 69.09,19.81 48.77,24.64 65.53,16.51 22.35,37.08 25.91,33.53
  pour Bottom (rank 6, no thermals): -10.41,82.55 110.49,82.55 110.49,-2.54 -10.41,-2.54
  pour Top (rank 6): -12.7,86.36 114.3,86.36 114.3,-5.84 -12.7,-6.35
HAZ_SWITCH
  Top 0.406: U$1.23 JP2.11 JP2.12 82.93,48.26 SWITCH_PANNEL.6
HORN
  Top 0.406: U$1.27 JP2.3 JP2.4 R26.1 R25.2
HORN_SWITCH
  Top 0.406: U$1.15 JP2.27 JP2.28 64.77,27.94 67.31,25.4 67.31,12.83 STEERING_WHEEL.8
L_LED
  Top 0.406: R4.2 44.2,14.48 36.83,21.84 36.83,28.19 JP1.21 JP1.22 U$1.11
L_SWITCH
  Top 0.406: U$1.14 JP1.28 JP1.27 43.94,27.69 42.93,27.69 41.4,26.16 41.4,23.37 43.18,21.59 56.39,21.59 64.64,13.34 STEERING_WHEEL.6
MISO
  Bottom 0.406: U$1.18 JP2.21 JP2.22 66.29,35.56 68.83,33.02 U$11.15 77.47,38.61 77.47,47.24 83.82,53.59 83.82,56.13 82.04,57.91 ISP.1
MOSI
  Top 0.406: U$1.17 JP2.23 JP2.24 | 63.5,32.77 JP2.24 | JP2.24 66.29,33.02 68.58,35.31 71.63,35.31 U$11.14
  Bottom 0.406: ISP.4 79.25,52.07 75.95,48.77 75.95,39.62 U$11.14
N$1
  Top 0.254: 88.39,17.03 R9.1
  Top 0.406: U$3.7 88.39,17.02 | 88.39,17.02 92.45,17.02 CAN_BUS.P$3 | 88.39,17.03 88.39,17.02
N$2
  Top 0.406: PWR_12V.C R8.1
N$3
  Top 0.406: 17.53,25.65 17.96,25.65 U$19.P$1
  Top 1.422: REAR_LIGHTS.4 13.59,19.94 15.75,22.1 15.75,24.64 16.76,25.65 17.53,25.65
N$4
  Top 0.254: C8.1 88.39,6.77 R12.1
N$5
  Top 1.016: ISP.2 81.79,53.85 81.03,53.09 JP9.1
N$6
  Top 0.254: R9.2 85.6,24.83 85.6,25.4 85.34,25.4 C7.1
N$7
  Top 0.254: 28.45,23.18 28.19,23.18 U$15.G
  Top 0.406: 28.45,23.18 R13.2
N$8
  Top 0.406: 34.8,67.56 U$12.D
  Top 1.27: FRONT_LIGHTS.1 31.24,70.1 33.53,67.82 34.54,67.82 34.8,67.56
N$9
  Top 0.254: R12.2 88.65,8.82 88.65,14.48
  Top 0.406: U$3.6 88.65,14.48 91.95,14.48 CAN_BUS.P$5
N$10
  Top 0.254: 17.45,30.54 17.78,30.21 | 17.27,32 17.45,32 U$17.P$1
  Top 1.422: 11.43,25.22 11.43,25.02 | 11.43,25.02 REAR_LIGHTS.1 | 11.43,25.02 11.43,24.89 | 11.43,24.89 11.43,23.75 REAR_LIGHTS.2 | 11.43,24.89 17.07,30.54 17.45,30.54 17.45,31.82 17.27,32
N$11
  Top 0.406: C3.1 40.57,37.08 U$4.P$1 43.11,37.01 JP1.19 JP1.20 U$1.10
N$12
  Top 0.406: STEERING_WHEEL.2 59.56,13.08 55.37,17.27 R3.1
N$13
  Top 0.406: STEERING_WHEEL.1 58.29,11.56 55.37,14.48 R4.1
N$14
  Top 1.27: FRONT_LIGHTS.3 25.27,72.52 26.42,73.66 33.02,73.66 U$10.D
N$15
  Top 0.406: R18.2 8.18,39.37 SERVO.3
N$16
  Top 0.406: U$9.G 23.75,61.53 R15.2
N$17
  Top 1.016: 21.46,62.61 U$9.D
  Top 1.778: FRONT_LIGHTS.8 FRONT_LIGHTS.6 21.46,62.61
N$18
  Top 1.016: D4.C 77.35,67.23 U$7.P$5
  pour Bottom (isolate 0.406, no thermals): 76.2,80.01 99.57,80.01 99.57,64.01 76.2,64.01
N$19
  Top 0.406: U$1.9 JP1.18 JP1.17 40.71,40.64 U$4.P$2 37.75,40.71 C4.2
  Bottom 0.406: 46.99,40.64 JP1.18
N$20
  Top 0.406: U$11.4 JP3.3
N$21
  Top 0.254: U$14.G 28.7,18.35
  Top 0.406: 28.7,18.35 R5.2
N$22  (via drill 0.6)
  Top 0.254: U$17.P$4 18.94,33.39 18.54,33.78 17.53,33.78 v15.24,31.5 15.11,31.37 13.72,29.97 R7.1 | R30.2 23.62,28.7 v23.11,28.19
  Bottom 0.254: v23.11,28.19 21.08,28.19 20.57,28.7 18.03,28.7 v15.24,31.5
N$23
  Top 1.016: JP11.2 JP10.P$4
N$24
  Top 0.254: U$13.G 24.38,33.53 24.89,33.02 24.89,30.55 R20.2
  Top 0.406: R20.2
N$25
  Top 1.27: 17.58,14.86 18.34,14.86 U$18.P$1
  Top 1.422: REAR_LIGHTS.8 17.58,14.86
N$26
  Top 0.406: U$3.8 85.09,19.56 83.31,21.34 83.31,25.4 86.43,28.51 R27.2
N$27
  Top 0.406: U$11.17 70.04,27.94 R1.1
N$28
  pour Top (isolate 0.406, no thermals): 75.95,63.25 99.82,63.25 99.82,79.76 76.2,79.76 75.69,79.76
N$29
  Top 0.406: R25.1 U$16.G
N$30
  Top 1.016: U$16.D 71.88,62.74 | 57.15,69.09 U$7.P$1 56.21,70.49 D1.C
  Top 1.27: 71.88,62.74 65.53,69.09 57.15,69.09
N$31  (via drill 0.6)
  Top 0.254: R11.1 21.78,19.62 v23.37,18.03 23.37,16.95 R28.2 | U$18.P$4 19.95,16.88 v19.3,17.53
  Bottom 0.254: v19.3,17.53 19.3,18.03 20.07,18.8 22.61,18.8 v23.37,18.03
N$32  (via drill 0.6)
  Top 0.254: R29.2 22.03,22.61 R10.2 21.84,22.42 21.84,23.62 23.11,24.89 v23.11,26.67 | U$19.P$4 19.19,26.81 v19.81,27.43
  Bottom 0.254: v19.81,27.43 22.35,27.43 v23.11,26.67
N$33
  Top 0.406: R19.1 36.13,74.68 U$10.G
N$34
  Top 0.254: R30.1 23.62,34.29 U$13.D
N$37
  Top 0.254: U$12.G 36.26,70.55 37.34,71.63 R23.1
  Top 0.406: R23.1 39.18,71.44
N$41
  Top 0.406: PWR_5V.C 94.53,32.23 R17.1
N$43
  Top 0.254: R28.1 24.45,14.8 24.89,15.24 U$14.D
N$45
  Top 0.254: U$15.D 25.15,24.64 26.16,23.62 26.16,22.67 R29.1
N$47
  Top 1.016: 15.07,50.92 U$5.CIRCUIT1
  Top 2.54: U$8.IN 11.94,57.66 14.22,55.37 U$5.CIRCUIT1
N$52
  Top 0.406: U$11.5 JP3.2
N$56
  Top 0.406: U$11.6 JP3.1
N$62
  Top 0.406: U$11.10 69.34,45.72 JP5.1
N$63
  Top 0.406: U$11.11 69.34,43.18 JP5.2
OSC1
  Top 0.406: U$11.8 82.37,43.18 U$6.P$2 84.93,42.74 C5.1
OSC2
  Top 0.406: C6.2 83.75,38.1 U$6.P$1 81.1,39.04 U$11.7
R_LED
  Top 0.406: R3.2 43.43,17.27 38.35,22.35 38.35,27.18 JP1.23 JP1.24 U$1.12
R_SWITCH
  Top 0.406: U$1.13 JP1.26 JP1.25 39.88,26.16 39.88,22.86 42.93,19.81 55.63,19.81 62.1,13.34 STEERING_WHEEL.4
RESET
  Top 0.406: C2.1 31.08,46.82 37.85,53.59 39.7,53.59 U$2.R1 39.81,56.57 JP1.1 | JP1.1 JP1.2 U$1.1 56.13,54.61 67.56,54.61 70.87,57.91 ISP.5 | R2.1 42.1,63.06 JP1.1
RX
  Bottom 0.406: JP10.P$3 29.46,47.75 33.27,51.56 33.27,54.86 36.83,58.42 JP1.3 JP1.4 U$1.2
SCK
  Top 0.406: U$1.19 JP2.19 JP2.20 U$11.13
  Bottom 0.406: ISP.3 79.25,58.17 77.47,59.94 75.69,59.94 74.17,58.42 74.17,40.39 U$11.13
SERVO  (via drill 0.6)
  Top 0.406: R18.1 26.16,39.37 v37.34,50.55
  Bottom 0.406: v37.34,50.55 43.94,50.55 JP1.9 JP1.10 U$1.5
TX
  Top 0.406: U$1.3 JP1.6
  Bottom 0.406: JP10.P$2 28.96,45.21 39.62,55.88 JP1.5 JP1.6
WIPER_SWITCH
  Top 0.406: U$1.24 JP2.9 JP2.10 82.93,50.8 SWITCH_PANNEL.8

### Text on the board
tPlace: HORN | FRONT_LIGHTS | SCK | 12V FUSE | RESET | MISO | GND | SWITCH_PANNEL | MOSI | 5V | 12V POWER | REAR_LIGHTS | STEERING WHEEL | UAlberta Ecocar | Auxiliaries Board | E-P-099-R2.2